# Altium schematic sheet Sheet2.SchDoc
size A4
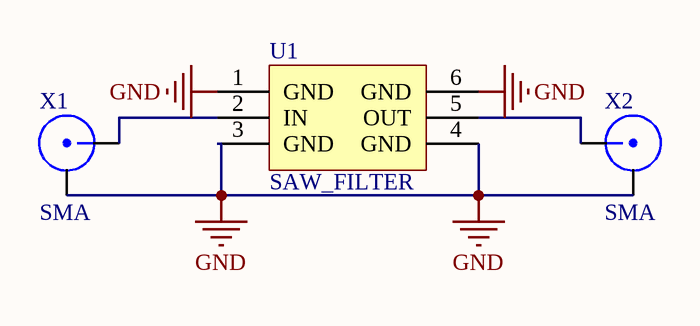
[diagram p0: Sheet2.SchDoc]

## Parts
U1  SAW_FILTER  [SAW_3.0]
X1  SMA  [SMA1]
X2  SMA  [SMA1]

## Nets
GND: U1.1(GND) U1.3(GND) U1.4(GND) U1.6(GND) X1.2 X2.2
NetU1_2: U1.2(IN) X1.1
NetU1_5: U1.5(OUT) X2.1